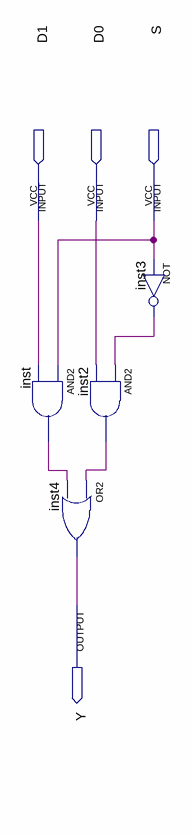
[diagram p0: schematic sheet]
// Quartus schematic Bit2Sel.bdf as structural Verilog: 4 symbols, 4 pins
module Bit2Sel (
  input  D1,
  input  D0,
  input  S,
  output Y
);

  wire inst2_out, inst3_out, inst_out;

  and inst (inst_out, S, D1);
  or inst4 (Y, inst2_out, inst_out);
  not inst3 (inst3_out, S);
  and inst2 (inst2_out, inst3_out, D0);
endmodule
